# EAGLE design durtest (EAGLE 6.0)
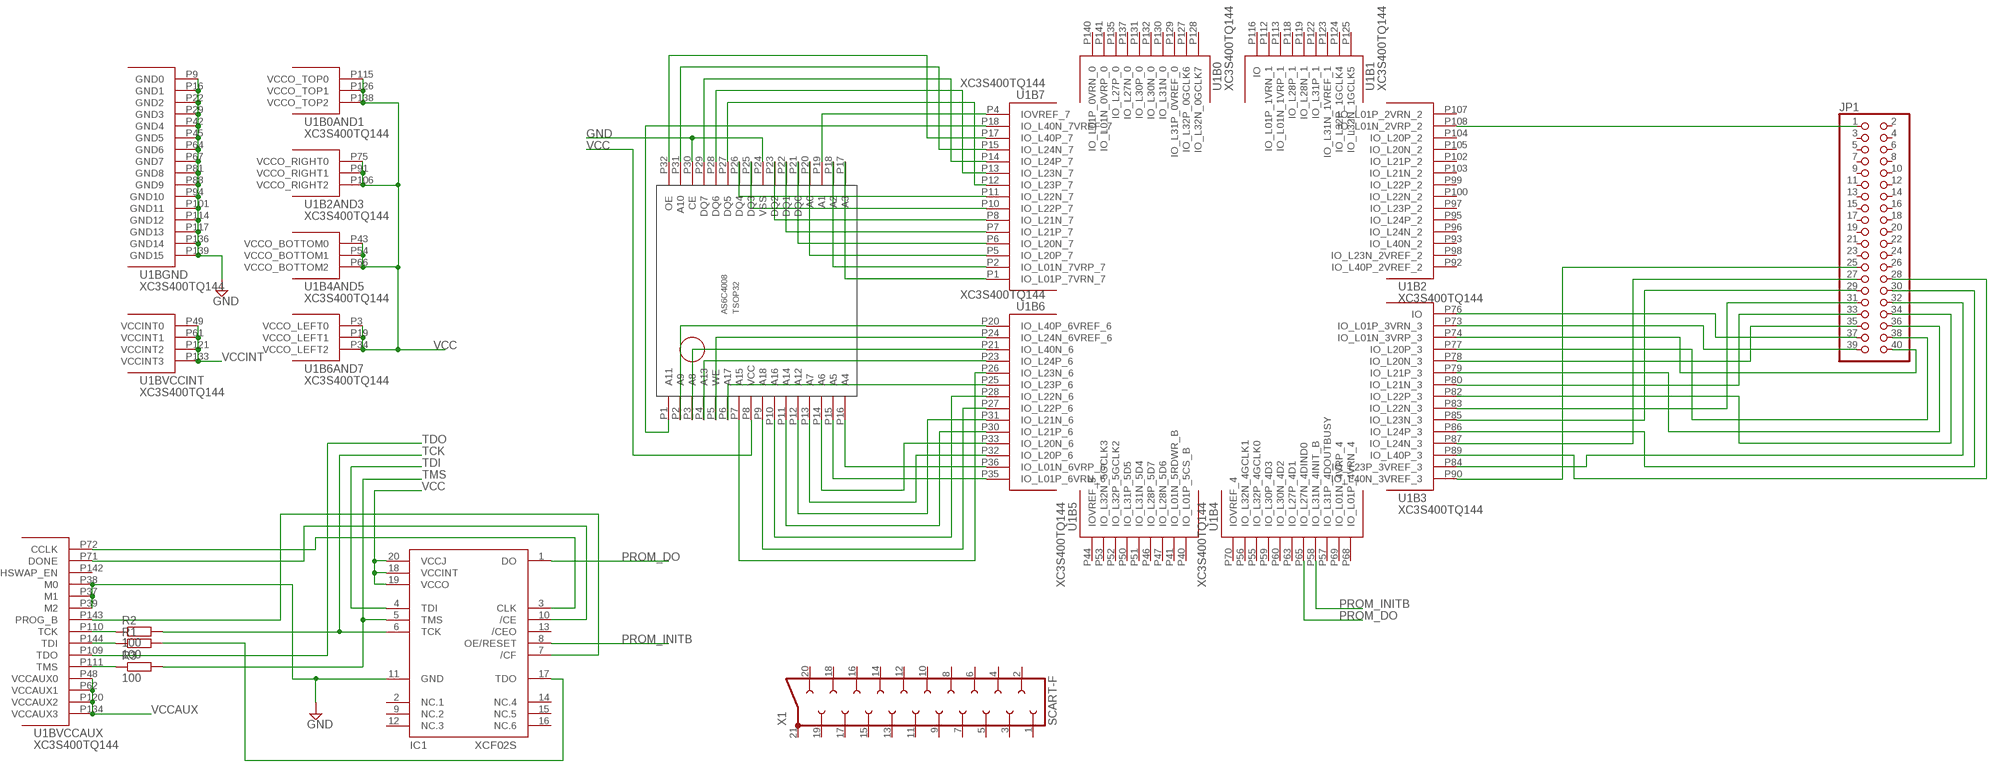
[diagram p0: schematic, sheet 1]

## Parts
IC1  XCF02S  [VO20]
JP1  PINHD-2X20  [2X20]
R1  100  R-EU_R0805  [R0805]
R2  100  R-EU_R0805  [R0805]
R3  100  R-EU_R0805  [R0805]
U1  XC3S400TQ144  [TQ144]
U$1  AS6C4008  [TSOP32]
X1  SCART-F  [SCART-F]

## Nets
GND: IC1.11(GND) U1.P9(BGND:GND0) U1.P16(BGND:GND1) U1.P22(BGND:GND2) U1.P29(BGND:GND3) U1.P37(BVCCAUX:M1) U1.P38(BVCCAUX:M0) U1.P39(BVCCAUX:M2) U1.P42(BGND:GND4) U1.P45(BGND:GND5) U1.P64(BGND:GND6) U1.P67(BGND:GND7) U1.P81(BGND:GND8) U1.P88(BGND:GND9) U1.P94(BGND:GND10) U1.P101(BGND:GND11) U1.P114(BGND:GND12) U1.P117(BGND:GND13) U1.P136(BGND:GND14) U1.P139(BGND:GND15) U$1.P24(VSS) U$1.P30(CE)
N$1: U1.P1(B7:IO_L01P_7VRN_7) U$1.P17(A3)
N$2: U1.P2(B7:IO_L01N_7VRP_7) U$1.P18(A2)
N$3: U1.P4(B7:IOVREF_7) U$1.P19(A1)
N$4: U1.P5(B7:IO_L20P_7) U$1.P20(A0)
N$5: U1.P6(B7:IO_L20N_7) U$1.P21(DQ0)
N$6: U1.P7(B7:IO_L21P_7) U$1.P22(DQ1)
N$7: U1.P8(B7:IO_L21N_7) U$1.P23(DQ2)
N$8: U1.P10(B7:IO_L22P_7) U$1.P25(DQ3)
N$9: U1.P11(B7:IO_L22N_7) U$1.P26(DQ4)
N$10: U1.P12(B7:IO_L23P_7) U$1.P27(DQ5)
N$11: U1.P13(B7:IO_L23N_7) U$1.P28(DQ6)
N$12: U1.P14(B7:IO_L24P_7) U$1.P29(DQ7)
N$13: U1.P15(B7:IO_L24N_7) U$1.P31(A10)
N$14: U1.P17(B7:IO_L40P_7) U$1.P32(OE)
N$15: U1.P18(B7:IO_L40N_7VREF_7) U$1.P1(A11)
N$16: U1.P20(B6:IO_L40P_6VREF_6) U$1.P2(A9)
N$17: U1.P21(B6:IO_L40N_6) U$1.P3(A8)
N$18: U1.P23(B6:IO_L24P_6) U$1.P4(A13)
N$19: U1.P24(B6:IO_L24N_6VREF_6) U$1.P5(WE)
N$20: U1.P25(B6:IO_L23P_6) U$1.P6(A17)
N$21: U1.P26(B6:IO_L23N_6) U$1.P7(A15)
N$22: U1.P27(B6:IO_L22P_6) U$1.P9(A18)
N$23: U1.P28(B6:IO_L22N_6) U$1.P10(A16)
N$24: U1.P30(B6:IO_L21P_6) U$1.P11(A14)
N$25: U1.P31(B6:IO_L21N_6) U$1.P12(A12)
N$26: U1.P32(B6:IO_L20P_6) U$1.P13(A7)
N$27: U1.P33(B6:IO_L20N_6) U$1.P14(A6)
N$28: U1.P35(B6:IO_L01P_6VRN_6) U$1.P15(A5)
N$29: U1.P36(B6:IO_L01N_6VRP_6) U$1.P16(A4)
N$30: JP1.1 U1.P108(B2:IO_L01N_2VRP_2)
N$31: JP1.39 U1.P73(B3:IO_L01P_3VRN_3)
N$32: JP1.40 U1.P74(B3:IO_L01N_3VRP_3)
N$33: JP1.37 U1.P76(B3:IO)
N$34: JP1.38 U1.P77(B3:IO_L20P_3)
N$35: IC1.3(CLK) U1.P72(BVCCAUX:CCLK)
N$36: IC1.17(TDO) R1.2
N$37: JP1.35 U1.P78(B3:IO_L20N_3)
N$38: IC1.10(/CE) U1.P71(BVCCAUX:DONE)
N$39: R2.1 U1.P110(BVCCAUX:TCK)
N$40: IC1.7(/CF) U1.P143(BVCCAUX:PROG_B)
N$41: JP1.36 U1.P79(B3:IO_L21P_3)
N$42: R1.1 U1.P144(BVCCAUX:TDI)
N$43: R3.1 U1.P111(BVCCAUX:TMS)
N$44: JP1.33 U1.P80(B3:IO_L21N_3)
N$45: JP1.34 U1.P82(B3:IO_L22P_3)
N$46: JP1.31 U1.P83(B3:IO_L22N_3)
N$47: JP1.32 U1.P84(B3:IO_L23P_3VREF_3)
N$48: JP1.29 U1.P85(B3:IO_L23N_3)
N$49: JP1.30 U1.P86(B3:IO_L24P_3)
N$50: JP1.27 U1.P87(B3:IO_L24N_3)
N$51: JP1.28 U1.P89(B3:IO_L40P_3)
N$52: JP1.25 U1.P90(B3:IO_L40N_3VREF_3)
PROM_DO: IC1.1(DO) U1.P65(B4:IO_L27N_4DIND0)
PROM_INITB: IC1.8(OE/RESET) U1.P58(B4:IO_L31N_4INIT_B)
TCK: IC1.6(TCK) R2.2
TDI: IC1.4(TDI)
TDO: U1.P109(BVCCAUX:TDO)
TMS: IC1.5(TMS) R3.2
VCC: IC1.18(VCCINT) IC1.19(VCCO) IC1.20(VCCJ) U1.P3(B6AND7:VCCO_LEFT0) U1.P19(B6AND7:VCCO_LEFT1) U1.P34(B6AND7:VCCO_LEFT2) U1.P43(B4AND5:VCCO_BOTTOM0) U1.P54(B4AND5:VCCO_BOTTOM1) U1.P66(B4AND5:VCCO_BOTTOM2) U1.P75(B2AND3:VCCO_RIGHT0) U1.P91(B2AND3:VCCO_RIGHT1) U1.P106(B2AND3:VCCO_RIGHT2) U1.P115(B0AND1:VCCO_TOP0) U1.P126(B0AND1:VCCO_TOP1) U1.P138(B0AND1:VCCO_TOP2) U$1.P8(VCC)
VCCAUX: U1.P48(BVCCAUX:VCCAUX0) U1.P62(BVCCAUX:VCCAUX1) U1.P120(BVCCAUX:VCCAUX2) U1.P134(BVCCAUX:VCCAUX3)
VCCINT: U1.P49(BVCCINT:VCCINT0) U1.P61(BVCCINT:VCCINT1) U1.P121(BVCCINT:VCCINT2) U1.P133(BVCCINT:VCCINT3)
Unconnected: IC1.2(NC.1) IC1.9(NC.2) IC1.12(NC.3) IC1.13(/CEO) IC1.14(NC.4) IC1.15(NC.5) IC1.16(NC.6) JP1.2 JP1.3 JP1.4 JP1.5 JP1.6 JP1.7 JP1.8 JP1.9 JP1.10 JP1.11 JP1.12 JP1.13 JP1.14 JP1.15 JP1.16 JP1.17 JP1.18 JP1.19 JP1.20 JP1.21 JP1.22 JP1.23 JP1.24 JP1.26 U1.P40(B5:IO_L01P_5CS_B) U1.P41(B5:IO_L01N_5RDWR_B) U1.P44(B5:IOVREF_5) U1.P46(B5:IO_L28P_5D7) U1.P47(B5:IO_L28N_5D6) U1.P50(B5:IO_L31P_5D5) U1.P51(B5:IO_L31N_5D4) U1.P52(B5:IO_L32P_5GCLK2) U1.P53(B5:IO_L32N_5GCLK3) U1.P55(B4:IO_L32P_4GCLK0) U1.P56(B4:IO_L32N_4GCLK1) U1.P57(B4:IO_L31P_4DOUTBUSY) U1.P59(B4:IO_L30P_4D3) U1.P60(B4:IO_L30N_4D2) U1.P63(B4:IO_L27P_4D1) U1.P68(B4:IO_L01P_4VRN_4) U1.P69(B4:IO_L01N_4VRP_4) U1.P70(B4:IOVREF_4) U1.P92(B2:IO_L40P_2VREF_2) U1.P93(B2:IO_L40N_2) U1.P95(B2:IO_L24P_2) U1.P96(B2:IO_L24N_2) U1.P97(B2:IO_L23P_2) U1.P98(B2:IO_L23N_2VREF_2) U1.P99(B2:IO_L22P_2) U1.P100(B2:IO_L22N_2) U1.P102(B2:IO_L21P_2) U1.P103(B2:IO_L21N_2) U1.P104(B2:IO_L20P_2) U1.P105(B2:IO_L20N_2) U1.P107(B2:IO_L01P_2VRN_2) U1.P112(B1:IO_L01P_1VRN_1) U1.P113(B1:IO_L01N_1VRP_1) U1.P116(B1:IO) U1.P118(B1:IO_L28P_1) U1.P119(B1:IO_L28N_1) U1.P122(B1:IO_L31P_1) U1.P123(B1:IO_L31N_1VREF_1) U1.P124(B1:IO_L32P_1GCLK4) U1.P125(B1:IO_L32N_1GCLK5) U1.P127(B0:IO_L32P_0GCLK6) U1.P128(B0:IO_L32N_0GCLK7) U1.P129(B0:IO_L31P_0VREF_0) U1.P130(B0:IO_L31N_0) U1.P131(B0:IO_L30P_0) U1.P132(B0:IO_L30N_0) U1.P135(B0:IO_L27P_0) U1.P137(B0:IO_L27N_0) U1.P140(B0:IO_L01P_0VRN_0) U1.P141(B0:IO_L01N_0VRP_0) U1.P142(BVCCAUX:HSWAP_EN) X1.1 X1.2 X1.3 X1.4 X1.5 X1.6 X1.7 X1.8 X1.9 X1.10 X1.11 X1.12 X1.13 X1.14 X1.15 X1.16 X1.17 X1.18 X1.19 X1.20 X1.21

## Library data of the parts
IC1 = smd-special:XCF02S
JP1 = pinhead:PINHD-2X20: PIN HEADER
R1-R3 = rcl:R-EU_: RESISTOR, European symbol
U1 = xilinx_spartan3_virtex4_and_5:XC3S400TQ144: Xilinx FPGA
U$1 = cpcfpga:AS6C4008
X1 = con-hirschmann:SCART-F: TV SCART CONNECTOR; OC_FARNELL: unknown; OC_NEWARK: unknown

## Board
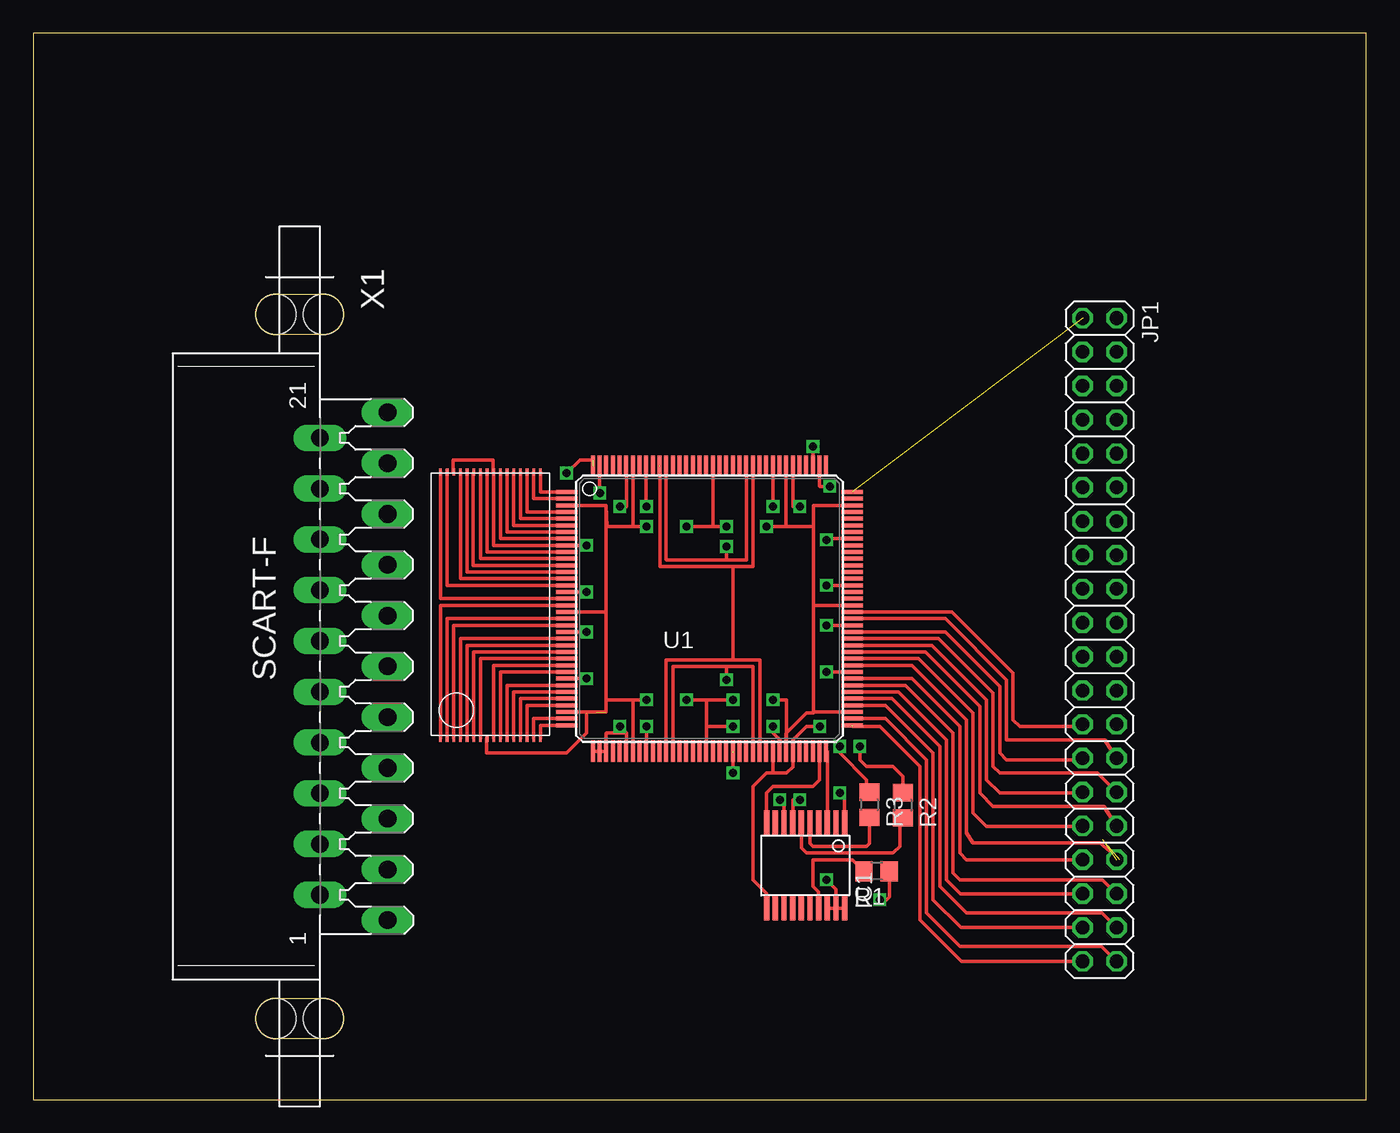
[diagram p1: board, top side]
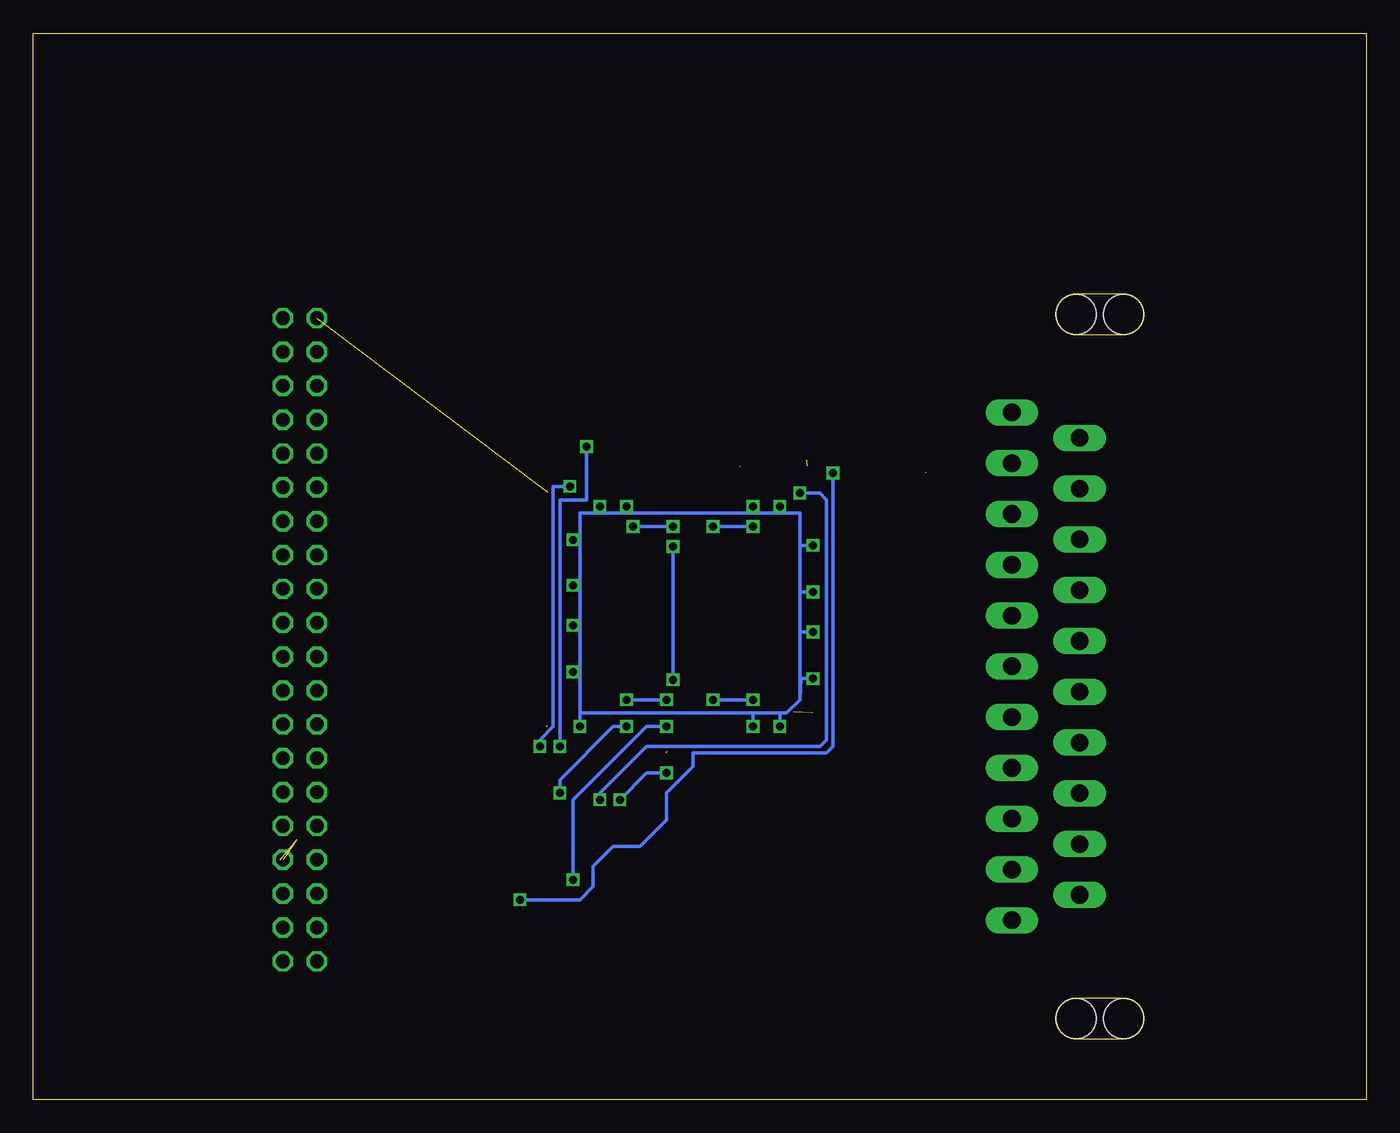
[diagram p2: board, bottom side, seen from below]

Size 100 x 80 mm. Coordinates in mm from the lower left corner, seen from the top.
Outline: 0,0 100,0 100,80 0,80 0,0
Copper layers (1*16): Top 0.0356mm / dielectric 1.5011mm / Bottom 0.0356mm
Design rules: minimum track width 6mil, minimum drill 13mil, track to track 6mil, track to pad 6mil, pad to pad 6mil, via to via 6mil, smd to smd 6mil, copper to edge 15mil, drill to drill 6mil, minimum pad ring 7mil, minimum via ring 7mil, stop-mask expansion 4mil, vias tented up to drill 0mil, thermal gap 10mil

### Footprints (pad centres in the part's own frame; a part is rotated, then mirrored left to right if it is on the bottom)
VO20 = smd 0.4 x 1.8: 1 5.85,6.15; 2 5.2,6.15; 3 4.55,6.15; 4 3.9,6.15; 5 3.25,6.15; 6 2.6,6.15; 7 1.95,6.15; 8 1.3,6.15; 9 0.65,6.15; 10 0,6.15; 11 0,-0.3; 12 0.65,-0.3; 13 1.3,-0.3; 14 1.95,-0.3; 15 2.6,-0.3; 16 3.25,-0.3; 17 3.9,-0.3; 18 4.55,-0.3; 19 5.2,-0.3; 20 5.85,-0.3
2X20 = drill 1.016 octagon: 1 -24.13,-1.27; 2 -24.13,1.27; 3 -21.59,-1.27; 4 -21.59,1.27; 5 -19.05,-1.27; 6 -19.05,1.27; 7 -16.51,-1.27; 8 -16.51,1.27; 9 -13.97,-1.27; 10 -13.97,1.27; 11 -11.43,-1.27; 12 -11.43,1.27; 13 -8.89,-1.27; 14 -8.89,1.27; 15 -6.35,-1.27; 16 -6.35,1.27; 17 -3.81,-1.27; 18 -3.81,1.27; 19 -1.27,-1.27; 20 -1.27,1.27; 21 1.27,-1.27; 22 1.27,1.27; 23 3.81,-1.27; 24 3.81,1.27; 25 6.35,-1.27; 26 6.35,1.27; 27 8.89,-1.27; 28 8.89,1.27; 29 11.43,-1.27; 30 11.43,1.27; 31 13.97,-1.27; 32 13.97,1.27; 33 16.51,-1.27; 34 16.51,1.27; 35 19.05,-1.27; 36 19.05,1.27; 37 21.59,-1.27; 38 21.59,1.27; 39 24.13,-1.27; 40 24.13,1.27
R0805 = smd 1.3 x 1.5: 1 -0.95,0; 2 0.95,0
TQ144 = smd 1.6 x 0.3: P1 -10.7,8.75; P2 -10.7,8.25; P3 -10.7,7.75; P4 -10.7,7.25; P5 -10.7,6.75; P6 -10.7,6.25; P7 -10.7,5.75; P8 -10.7,5.25; P9 -10.7,4.75; P10 -10.7,4.25; P11 -10.7,3.75; P12 -10.7,3.25; P13 -10.7,2.75; P14 -10.7,2.25; P15 -10.7,1.75; P16 -10.7,1.25; P17 -10.7,0.75; P18 -10.7,0.25; P19 -10.7,-0.25; P20 -10.7,-0.75; P21 -10.7,-1.25; P22 -10.7,-1.75; P23 -10.7,-2.25; P24 -10.7,-2.75; P25 -10.7,-3.25; P26 -10.7,-3.75; P27 -10.7,-4.25; P28 -10.7,-4.75; P29 -10.7,-5.25; P30 -10.7,-5.75; P31 -10.7,-6.25; P32 -10.7,-6.75; P33 -10.7,-7.25; P34 -10.7,-7.75; P35 -10.7,-8.25; P36 -10.7,-8.75; P73 10.7,-8.75; P74 10.7,-8.25; P75 10.7,-7.75; P76 10.7,-7.25; P77 10.7,-6.75; P78 10.7,-6.25; P79 10.7,-5.75; P80 10.7,-5.25; P81 10.7,-4.75; P82 10.7,-4.25; P83 10.7,-3.75; P84 10.7,-3.25; P85 10.7,-2.75; P86 10.7,-2.25; P87 10.7,-1.75; P88 10.7,-1.25; P89 10.7,-0.75; P90 10.7,-0.25; P91 10.7,0.25; P92 10.7,0.75; P93 10.7,1.25; P94 10.7,1.75; P95 10.7,2.25; P96 10.7,2.75; P97 10.7,3.25; P98 10.7,3.75; P99 10.7,4.25; P100 10.7,4.75; P101 10.7,5.25; P102 10.7,5.75; P103 10.7,6.25; P104 10.7,6.75; P105 10.7,7.25; P106 10.7,7.75; P107 10.7,8.25; P108 10.7,8.75 | smd 0.3 x 1.6: P37 -8.75,-10.7; P38 -8.25,-10.7; P39 -7.75,-10.7; P40 -7.25,-10.7; P41 -6.75,-10.7; P42 -6.25,-10.7; P43 -5.75,-10.7; P44 -5.25,-10.7; P45 -4.75,-10.7; P46 -4.25,-10.7; P47 -3.75,-10.7; P48 -3.25,-10.7; P49 -2.75,-10.7; P50 -2.25,-10.7; P51 -1.75,-10.7; P52 -1.25,-10.7; P53 -0.75,-10.7; P54 -0.25,-10.7; P55 0.25,-10.7; P56 0.75,-10.7; P57 1.25,-10.7; P58 1.75,-10.7; P59 2.25,-10.7; P60 2.75,-10.7; P61 3.25,-10.7; P62 3.75,-10.7; P63 4.25,-10.7; P64 4.75,-10.7; P65 5.25,-10.7; P66 5.75,-10.7; P67 6.25,-10.7; P68 6.75,-10.7; P69 7.25,-10.7; P70 7.75,-10.7; P71 8.25,-10.7; P72 8.75,-10.7; P109 8.75,10.7; P110 8.25,10.7; P111 7.75,10.7; P112 7.25,10.7; P113 6.75,10.7; P114 6.25,10.7; P115 5.75,10.7; P116 5.25,10.7; P117 4.75,10.7; P118 4.25,10.7; P119 3.75,10.7; P120 3.25,10.7; P121 2.75,10.7; P122 2.25,10.7; P123 1.75,10.7; P124 1.25,10.7; P125 0.75,10.7; P126 0.25,10.7; P127 -0.25,10.7; P128 -0.75,10.7; P129 -1.25,10.7; P130 -1.75,10.7; P131 -2.25,10.7; P132 -2.75,10.7; P133 -3.25,10.7; P134 -3.75,10.7; P135 -4.25,10.7; P136 -4.75,10.7; P137 -5.25,10.7; P138 -5.75,10.7; P139 -6.25,10.7; P140 -6.75,10.7; P141 -7.25,10.7; P142 -7.75,10.7; P143 -8.25,10.7; P144 -8.75,10.7
TSOP32 = smd 0.5 x 0.2: P1 -9.75,3.75; P2 -9.75,3.25; P3 -9.75,2.75; P4 -9.75,2.25; P5 -9.75,1.75; P6 -9.75,1.25; P7 -9.75,0.75; P8 -9.75,0.25; P9 -9.75,-0.25; P10 -9.75,-0.75; P11 -9.75,-1.25; P12 -9.75,-1.75; P13 -9.75,-2.25; P14 -9.75,-2.75; P15 -9.75,-3.25; P16 -9.75,-3.75; P17 10.25,-3.75; P18 10.25,-3.25; P19 10.25,-2.75; P20 10.25,-2.25; P21 10.25,-1.75; P22 10.25,-1.25; P23 10.25,-0.75; P24 10.25,-0.25; P25 10.25,0.25; P26 10.25,0.75; P27 10.25,1.25; P28 10.25,1.75; P29 10.25,2.25; P30 10.25,2.75; P31 10.25,3.25; P32 10.25,3.75
SCART-F = drill 1.321 long: 1 19.05,5.08; 2 17.145,0; 3 15.24,5.08; 4 13.335,0; 5 11.43,5.08; 6 9.525,0; 7 7.62,5.08; 8 5.715,0; 9 3.81,5.08; 10 1.905,0; 11 0,5.08; 12 -1.905,0; 13 -3.81,5.08; 14 -5.715,0; 15 -7.62,5.08; 16 -9.525,0; 17 -11.43,5.08; 18 -13.335,0; 19 -15.24,5.08; 20 -17.145,0; 21 -19.05,5.08 | hole 3.023: 26.416,0.254; 26.416,-3.302; -26.416,0.254; -26.416,-3.302

### Placement (x,y rotation side)
IC1  55.02,14.63 0 top
JP1  80,34.5 270 top
R1  63.27,17.14 180 top
R2  65.24,22.08 270 top
R3  62.72,22.12 270 top
U1  50.73,36.83 0 top
U$1  34.29,36.83 90 top
X1  21.5,32.5 270 top

### Tracks (layer width: path | path; a pad name or v marks a point on that pad's centre or on a via)
GND  (via drill 0.6)
  Top 0.254: IC1.11 55.02,15.48 54,16.5 54,23.5 55,24.5 55.5,24.5 | 55.5,24.5 55.5,26.11 U1.P64 | 55.5,24.5 56.5,24.5 56.98,24.98 U1.P67 56.98,26.98 58,28 v59,28 | U1.P139 44.5,47.53 44.5,44.5 v44,44.5 | U1.P16 v41.5,38.08 | v41.5,41.58 U1.P9 34.54,41.58 U$1.P24 34.5,47.08 34.5,48 31.5,48 31.5,47.08 U$1.P30 | U1.P22 v41.5,35.08 | U1.P29 v41.5,31.58 | U1.P94 v59.5,38.58 | U1.P81 v59.5,32.08 | U1.P88 v59.5,35.58 | U1.P45 46,26.13 v46,28 | U1.P42 44.5,26.13 44.5,27.5 | 44.5,27.5 v44,28 | U1.P37 U1.P38 U1.P39 42.98,27.48 43,27.5 44.5,27.5 | U1.P136 45.98,44.52 v46,44.5 | U1.P114 56.98,46.52 57,45 57,44.5 v57.5,44.5 | U1.P117 55.48,46.52 v55.5,44.5 | U1.P101 59.58,42.08 v59.5,42
  Bottom 0.254: v41.5,41.58 42.42,41.58 | 42.42,41.58 42.5,41.5 42.5,38 | v41.5,38.08 42.42,38.08 42.5,38 | v41.5,35.08 42.42,35.08 42.5,35 | 42.5,35 42.5,38 | v41.5,31.58 42.42,31.58 42.5,30 | 42.5,30 42.5,35 | v44,28 44,29 | 44,29 43.5,29 42.5,30 | v46,28 46,29 | 46,29 44,29 | 42.42,41.58 42.5,41.66 42.5,44 44,44 | 44,44 v44,44.5 | v46,44.5 46,44 | 46,44 44,44 | v57.5,44.5 57.5,44 | 59,42 59,44 58,44 57.5,44 | 59,42 59,38.5 | 59,35.5 59,32 | 59,32 59,29 | v55.5,44.5 55.5,44 | 55.5,44 57.5,44 | v59.5,42 59,42 | v59.5,38.58 59.08,38.58 59,38.5 | v59.5,35.58 59.08,35.58 59,35.5 | v59.5,32.08 59.08,32.08 59,32 | 59,35.5 59,38.5 | 55.5,44 46,44 | 59,29 46,29 | v59,28 59,29
N$1
  Top 0.254: U1.P1 38.04,45.58 U$1.P17
N$2
  Top 0.254: U1.P2 37.54,45.08 U$1.P18
N$3
  Top 0.254: U1.P4 37.04,44.08 U$1.P19
N$4
  Top 0.254: U1.P5 36.54,43.58 U$1.P20
N$5
  Top 0.254: U1.P6 36.04,43.08 U$1.P21
N$6
  Top 0.254: U1.P7 35.54,42.58 U$1.P22
N$7
  Top 0.254: U1.P8 35.04,42.08 U$1.P23
N$8
  Top 0.254: U1.P10 34.04,41.08 U$1.P25
N$9
  Top 0.254: U1.P11 33.54,40.58 U$1.P26
N$10  (1 unrouted)
  Top 0.254: U1.P12 33,40.08 33,47
N$11
  Top 0.254: U1.P13 32.54,39.58 U$1.P28
N$12
  Top 0.254: U1.P14 32.04,39.08 U$1.P29
N$13
  Top 0.254: U1.P15 31.04,38.58 U$1.P31
N$14
  Top 0.254: U1.P17 30.54,37.58 U$1.P32
N$15
  Top 0.254: U1.P18 30.54,37.08 U$1.P1
N$16
  Top 0.254: U1.P20 31.04,36.08 U$1.P2
N$17
  Top 0.254: U1.P21 31.54,35.58 U$1.P3
N$18
  Top 0.254: U1.P23 32.04,34.58 U$1.P4
N$19
  Top 0.254: U1.P24 32.54,34.08 U$1.P5
N$20
  Top 0.254: U1.P25 33.04,33.58 U$1.P6
N$21
  Top 0.254: U1.P26 33.54,33.08 U$1.P7
N$22
  Top 0.254: U1.P27 34.54,32.58 U$1.P9
N$23
  Top 0.254: U1.P28 35.04,32.08 U$1.P10
N$24
  Top 0.254: U1.P30 35.54,31.08 U$1.P11
N$25
  Top 0.254: U1.P31 36.04,30.58 U$1.P12
N$26
  Top 0.254: U1.P32 36.54,30.08 U$1.P13
N$27
  Top 0.254: U1.P33 37.04,29.58 U$1.P14
N$28
  Top 0.254: U1.P35 37.54,28.58 U$1.P15
N$29
  Top 0.254: U1.P36 38.04,28.08 U$1.P16
N$30  (1 unrouted)
N$31  (1 unrouted)
  Top 0.254: JP1.39 69.63,10.37 66.5,13.5 66.5,25 63.5,28 61.5,28
N$32
  Top 0.254: U1.P74 63.92,28.58 67,25.5 67,14 69.5,11.5 80.14,11.5 JP1.40
N$33
  Top 0.254: JP1.37 69.59,12.91 67.5,15 67.5,26 63.92,29.58 U1.P76
N$34
  Top 0.254: U1.P77 64.42,30.08 68,26.5 68,16 70,14 80.18,14 JP1.38
N$35
  Top 0.254: U1.P72 59.57,26.13 IC1.3
N$36
  Top 0.254: IC1.17 58.92,15.58 58.5,16 58.5,18 61.45,18 R1.2
N$37
  Top 0.254: JP1.35 69.55,15.45 68.5,16.5 68.5,27 64.92,30.58 U1.P78
N$38
  Top 0.254: U1.P71 58.98,23.98 58.5,23.5 55.5,23.5 55,23 55,20.8 IC1.10
N$39  (via drill 0.6)
  Top 0.254: U1.P110 58.98,46.02 59,46 v59.75,46.01 | v62,26.5 62,25.5 62.5,25 64.5,25 65.24,24.26 R2.1
  Bottom 0.254: v59.75,46.01 61,46 61,28 62,27 v62,26.5
N$40  (via drill 0.6)
  Top 0.254: U1.P143 42.48,46.02 42.5,46 v42.5,45.5 | v57.5,22.5 57,22.5 57,20.81 IC1.7
  Bottom 0.254: v42.5,45.5 41,45.5 40.5,45 40.5,27 41,26.5 54,26.5 57.5,23 v57.5,22.5
N$41
  Top 0.254: U1.P79 65.42,31.08 69,27.5 69,17 69.5,16.5 80.22,16.5 JP1.36
N$42  (via drill 0.6)  (1 unrouted)
  Top 0.254: R1.1 64.22,15.22 64,15 v63.5,15 | v40,47 41,48 42,48
  Bottom 0.254: v63.5,15 59,15 58,16 58,17.5 56.5,19 54.5,19 52.5,21 52.5,23 50.5,25 50.5,26 40.5,26 40,26.5 v40,47
N$43  (via drill 0.6)
  Top 0.254: U1.P111 58.48,48.98 v58.5,49 | 62.66,23 R3.1 62.5,23.29 62.5,24 60.5,26 v60.5,26.5
  Bottom 0.254: v58.5,49 58.5,45 60.5,45 v60.5,26.5
N$44
  Top 0.254: U1.P80 65.92,31.58 69.5,28 69.5,18.5 70,18 JP1.33
N$45  (2 unrouted)
  Top 0.254: U1.P82 65.92,32.58 70,28.5 70,20 70.5,19.25 80,19.25 81.5,18
N$46
  Top 0.254: U1.P83 66.42,33.08 70.5,29 70.5,21.5 71.5,20.5 78.7,20.5 JP1.31
N$47
  Top 0.254: U1.P84 66.92,33.58 71,29.5 71,23 72,22 80.3,22 JP1.32
N$48
  Top 0.254: U1.P85 67.42,34.08 71.5,30 71.5,24 72.5,23 78.66,23 JP1.29
N$49
  Top 0.254: U1.P86 67.92,34.58 72,30.5 72,25 72.5,24.5 79.84,24.5 JP1.30
N$50
  Top 0.254: U1.P87 68.42,35.08 72.5,31 72.5,26 73,25.5 78.62,25.5 JP1.27
N$51
  Top 0.254: U1.P89 68.42,36.08 73,31.5 73,27 80.38,27 JP1.28
N$52
  Top 0.254: U1.P90 68.92,36.58 73.5,32 73.5,28.5 74,28 78.58,28 JP1.25
PROM_DO  (via drill 0.6)
  Top 0.254: IC1.1 60.87,22.63 v60.5,23 | v55.5,28 55.5,27.5 56,27 56,26.16 U1.P65
  Bottom 0.254: v60.5,23 60.5,24 56.5,28 v55.5,28
PROM_INITB  (via drill 0.6)  (1 unrouted)
  Top 0.254: IC1.8 56.32,22.18 v56,22.5 | v52.5,24.5 52.5,26
  Bottom 0.254: v56,22.5 54,24.5 v52.5,24.5
TCK
  Top 0.254: IC1.6 57.62,18.88 58,18.5 64.5,18.5 65,19 65,20.89 R2.2
TMS
  Top 0.254: R3.2 62.72,19.22 62.5,19 58.5,19 58.27,19.23 IC1.5
VCC  (via drill 0.6)  (1 unrouted)
  Top 0.254: U1.P3 42.95,44.58 | 42.95,44.58 42.95,36.58 | 42.95,36.58 40.1,36.58 U1.P19 | U1.P34 42.95,29.08 42.95,30 | 42.95,30 42.95,36.58 | U1.P106 58.55,44.58 58.55,43 | 58.55,29.08 58.55,37.08 | 58.55,37.08 58.55,43 | U1.P91 58.55,37.08 | IC1.19 IC1.20 | U1.P75 58.55,29.08 | 58.55,29.08 58.55,29 58,29 56.48,27.48 U1.P66 56.5,26.13 56.5,30 v55.5,30 | U1.P43 45,26.16 45,30 | U1.P138 44.98,43.02 45,43 | 45,43 43.03,43 42.95,44.58 | U1.P115 56.48,43.02 56.5,43 | 56.5,43 58.55,43 | U1.P126 51,47.53 51,43 | 51,43 v49,43 | v46,43 45,43 | 51,43 v52,43 | v55,43 56.5,43 | 45,30 42.95,30 | U1.P54 50.5,26.13 50.5,28 | 50.5,28 50.5,30 | 50.5,30 v49,30 | v46,30 45,30 | v52.5,30 50.5,30 | U$1.P8 34,27.08 34,26 40,26 41.5,27.5 41.5,29 | IC1.19 60.22,15.78 v59.5,16.5 | v52.5,28 50.5,28 | IC1.19 IC1.18
  Bottom 0.254: v49,43 v46,43 | v52,43 v55,43 | v49,30 v46,30 | v55.5,30 v52.5,30 | v59.5,16.5 59.5,22.5 54,28 v52.5,28
VCCAUX  (1 unrouted)
  Top 0.254: U1.P120 54,47.53 54,40 52.5,40 | 52.5,40 47,40 47,47.5 | U1.P62 54.5,26.13 54.5,33 52.5,33 | 52.5,33 47.48,33 U1.P48 | 52.5,33 52.5,40
VCCINT  (via drill 0.6)
  Top 0.254: U1.P61 54,26.13 54,32.5 52,32.5 | 52,32.5 47.98,32.5 U1.P49 | U1.P133 47.48,40.52 47.5,40.5 52,40.5 | 52,40.5 53.5,40.5 53.5,47.51 U1.P121 | 52,32.5 v52,31.5 | v52,41.5 52,40.5
  Bottom 0.254: v52,31.5 v52,41.5